# Altium schematic sheet Sheet1-Renamed.SchDoc
size A
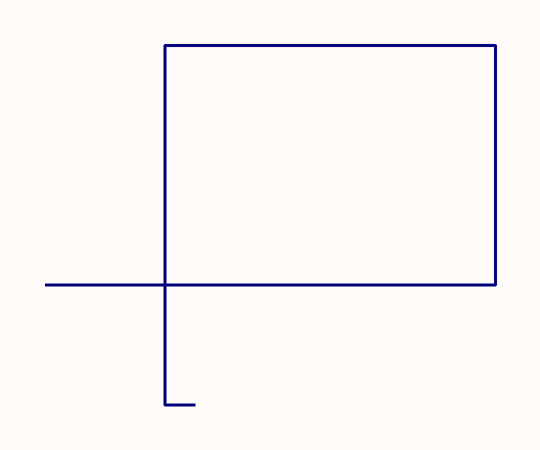
[diagram p0: Sheet1-Renamed.SchDoc]